# Altium project BSPDLukas.PrjPcb
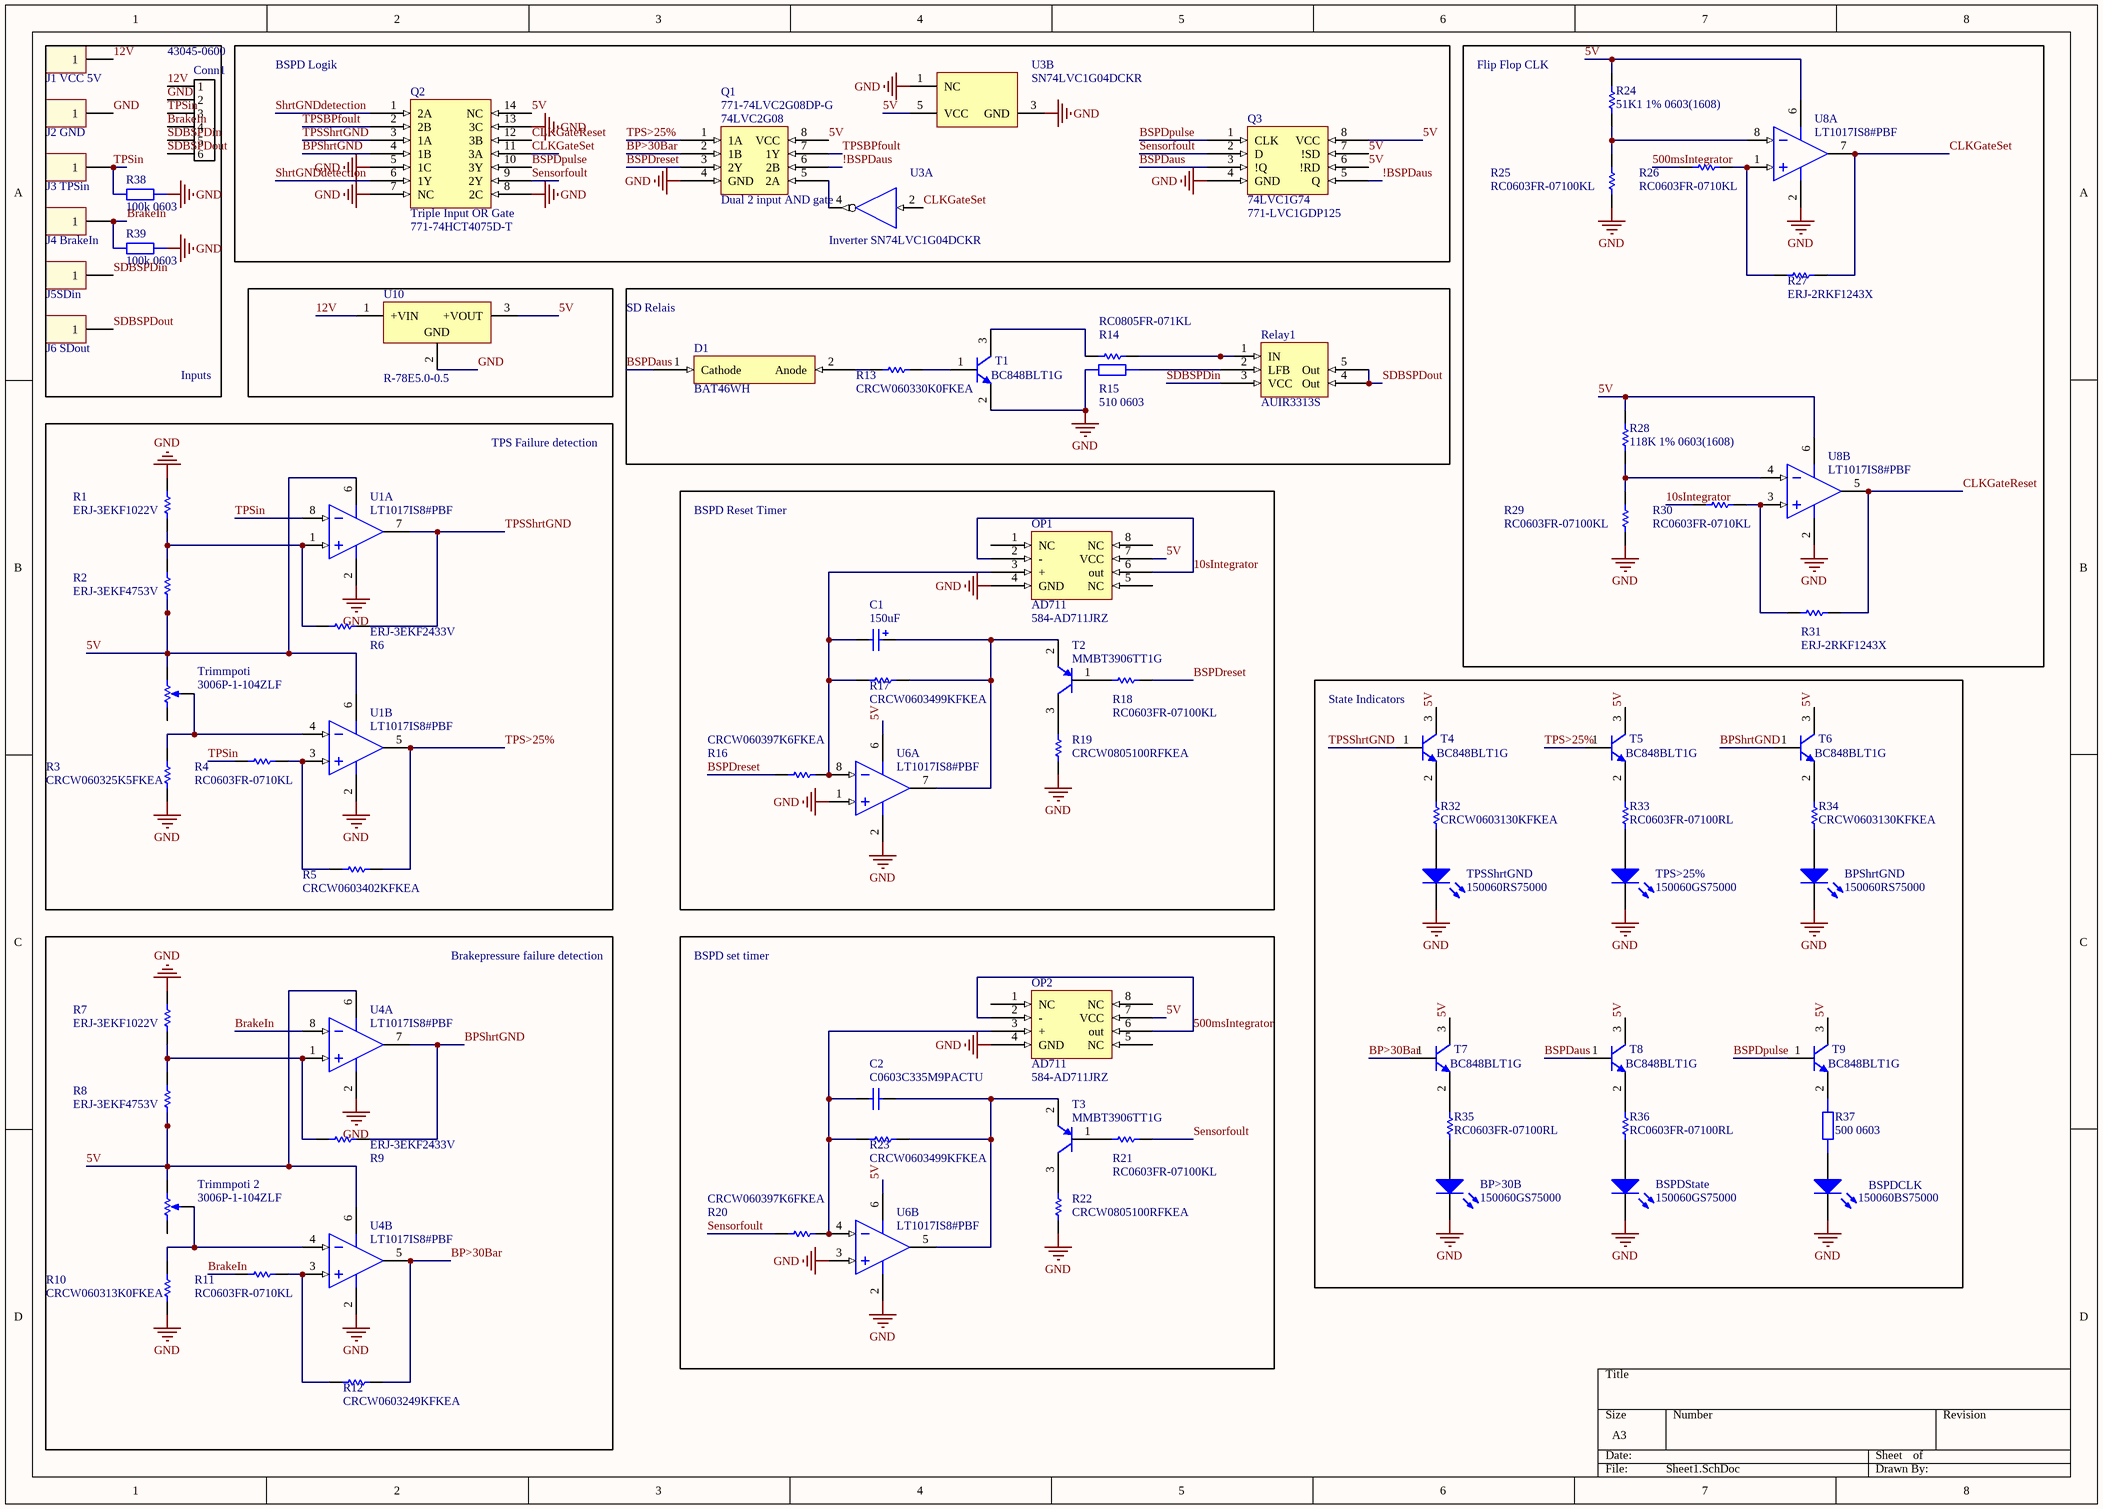
[diagram p0: Sheet1.SchDoc]
1 sheet, 78 parts. Net scope: global (net labels, ports and power ports of the same name join across sheets).
Board files: PCB_BSPDV1_1.PcbDoc, PCB_BSPDV1_2.PcbDoc

## Sheet Sheet1.SchDoc
size A3

### Parts
BP>30B  150060GS75000  [0603_A]
BPShrtGND  150060RS75000  [0603_A]
BSPDCLK  150060BS75000  [0603_A]
BSPDState  150060GS75000  [0603_A]
C1  value 150uF  [WCAP-PSLC_10x12.4]  (hidden comment: 875075561006)
C2  C0603C335M9PACTU  [CAPC1608X90X35NL15T15]
Conn1  43045-0600  [43045-0600]
D1  BAT46WH  [DIOM2715X18N]
J1_VCC_5V  61300111121  [61300111121]  (value not drawn)
J2_GND  61300111121  [61300111121]  (value not drawn)
J3_TPSin  61300111121  [61300111121]  (value not drawn)
J4_BrakeIn  61300111121  [61300111121]  (value not drawn)
J5SDin  61300111121  [61300111121]  (value not drawn)
J6_SDout  61300111121  [61300111121]  (value not drawn)
OP1  AD711  Supplier Part Number 1: 584-AD711JRZ  [SOIC8; SOIC127P600X175-8N]
OP2  AD711  Supplier Part Number 1: 584-AD711JRZ  [SOIC8; SOIC127P600X175-8N]
Q1  Dual 2 input AND gate  Supplier Part Number 1: 771-74LVC2G08DP-G  [TSSOP8; TSOP65P400X110-8N]
Q2  Triple Input OR Gate  Supplier Part Number 1: 771-74HCT4075D-T  [SOIC14; SOIC127P600X175-14N]
Q3  74LVC1G74  Supplier Part Number 1: 771-LVC1GDP125  [TSSOP8; TSOP65P400X110-8N]
R1  ERJ-3EKF1022V  [RESC1608X55X30LL15T15]
R2  ERJ-3EKF4753V  [RESC1608X55X30LL15T15]
R3  CRCW060325K5FKEA  [RESC1609X50X30ML10T20]
R4  RC0603FR-0710KL  [RESC1608X55X25ML10T15]
R5  CRCW0603402KFKEA  [RESC1609X50X30ML10T20]
R6  ERJ-3EKF2433V  [RESC1608X55X30ML15T15]
R7  ERJ-3EKF1022V  [RESC1608X55X30LL15T15]
R8  ERJ-3EKF4753V  [RESC1608X55X30LL15T15]
R9  ERJ-3EKF2433V  [RESC1608X55X30ML15T15]
R10  CRCW060313K0FKEA  [RESC1609X50X30NL10T20]
R11  RC0603FR-0710KL  [RESC1608X55X25ML10T15]
R12  CRCW0603249KFKEA  [RESC1609X50X30NL10T20]
R13  CRCW060330K0FKEA  [RESC1609X50X30LL10T20]
R14  RC0805FR-071KL  [RESC2013X60X35ML10T20]
R15  value 510 0603  [STACKPOLE CSR0603]  (hidden comment: SMD Resistor)
R16  CRCW060397K6FKEA  [RESC1609X50X30LL10T20]
R17  CRCW0603499KFKEA  [RESC1609X50X30NL10T20]
R18  RC0603FR-07100KL  [RESC1608X55X25ML10T15]
R19  CRCW0805100RFKEA  [RESC2013X50X30LL20T20]
R20  CRCW060397K6FKEA  [RESC1609X50X30LL10T20]
R21  RC0603FR-07100KL  [RESC1608X55X25ML10T15]
R22  CRCW0805100RFKEA  [RESC2013X50X30LL20T20]
R23  CRCW0603499KFKEA  [RESC1609X50X30NL10T20]
R24  51K1 1% 0603(1608)  [RESC0603(1608)_L]
R25  RC0603FR-07100KL  [RESC1608X55X25ML10T15]
R26  RC0603FR-0710KL  [RESC1608X55X25ML10T15]
R27  ERJ-2RKF1243X  [RESC1005X40X25NL05T05]
R28  118K 1% 0603(1608)  [RESC0603(1608)_M]
R29  RC0603FR-07100KL  [RESC1608X55X25ML10T15]
R30  RC0603FR-0710KL  [RESC1608X55X25ML10T15]
R31  ERJ-2RKF1243X  [RESC1005X40X25NL05T05]
R32  CRCW0603130KFKEA  [RESC1609X50X30NL10T20]
R33  RC0603FR-07100RL  [RESC1608X55X25ML10T15]
R34  CRCW0603130KFKEA  [RESC1609X50X30NL10T20]
R35  RC0603FR-07100RL  [RESC1608X55X25ML10T15]
R36  RC0603FR-07100RL  [RESC1608X55X25ML10T15]
R37  value 500 0603  [STACKPOLE CSR0603]  (hidden comment: SMD Resistor)
R38  value 100k 0603  [STACKPOLE CSR0603]  (hidden comment: SMD Resistor)
R39  value 100k 0603  [STACKPOLE CSR0603]  (hidden comment: SMD Resistor)
Relay1  AUIR3313S  [D2PAK5 ;DPAK228P1524X483-5N]
T1  BC848BLT1G  [ONSC-SOT-23-3-318-08_V]
T2  MMBT3906TT1G  [ONSC-SC-75-3-463-01_V]
T3  MMBT3906TT1G  [ONSC-SC-75-3-463-01_V]
T4  BC848BLT1G  [ONSC-SOT-23-3-318-08_V]
T5  BC848BLT1G  [ONSC-SOT-23-3-318-08_V]
T6  BC848BLT1G  [ONSC-SOT-23-3-318-08_V]
T7  BC848BLT1G  [ONSC-SOT-23-3-318-08_V]
T8  BC848BLT1G  [ONSC-SOT-23-3-318-08_V]
T9  BC848BLT1G  [ONSC-SOT-23-3-318-08_V]
TPS>25%  150060GS75000  [0603_A]
TPSShrtGND  150060RS75000  [0603_A]
Trimmpoti  3006P-1-104ZLF  [BOUR-3006P-3_V]
Trimmpoti_2  3006P-1-104ZLF  [BOUR-3006P-3_V]
U1  LT1017IS8#PBF  [LT-S8_N]  (parts A,B of 2)
U3  Inverter SN74LVC1G04DCKR  [DCK0005A_N]  (parts A,B of 2)
U4  LT1017IS8#PBF  [LT-S8_N]  (parts A,B of 2)
U6  LT1017IS8#PBF  [LT-S8_N]  (parts A,B of 2)
U8  LT1017IS8#PBF  [LT-S8_N]  (parts A,B of 2)
U10  R-78E5.0-0.5  [REPO-R-78E-0.5-3_V]

### Blocks framed on the sheet
Inputs: Conn1 J1_VCC_5V J2_GND J3_TPSin J4_BrakeIn J5SDin J6_SDout R38 R39
BSPD Logik: Q1-Q3 U3
Flip Flop CLK: R24-R31 U8
SD Relais: D1 R13-R15 Relay1 T1
TPS Failure detection: R1-R6 Trimmpoti U1
BSPD Reset Timer: C1 OP1 R16-R19 T2 U6
State Indicators: BP>30B BPShrtGND BSPDCLK BSPDState R32-R37 T4-T9 TPS>25% TPSShrtGND
Brakepressure failure detection: R7-R12 Trimmpoti_2 U4
BSPD set timer: C2 OP2 R20-R23 T3 U6

### Nets
GND: BP>30B.1(K) BPShrtGND.1(K) BSPDCLK.1(K) BSPDState.1(K) Conn1.2 J2_GND.1 OP1.4(GND) OP2.4(GND) Q1.4(GND) Q2.5(1C) Q2.7(NC) Q2.8(2C) Q2.13(3C) Q3.4(GND) R1.2 R3.1 R7.2 R10.1 R15.1 R19.2 R22.2 R25.1 R29.1 R38.2 R39.2 T1.2(E) TPS>25%.1(K) TPSShrtGND.1(K) U1.2(V-) U3.1(NC) U3.3(GND) U4.2(V-) U6.1(+IN_A) U6.2(V-) U6.3(+IN_B) U8.2(V-) U10.2(GND)
5V: OP1.7(VCC) OP2.7(VCC) Q1.8(VCC) Q2.14(NC) Q3.6(!RD) Q3.7(!SD) Q3.8(VCC) R2.1 R8.1 R24.2 R28.2 T4.3(C) T5.3(C) T6.3(C) T7.3(C) T8.3(C) T9.3(C) Trimmpoti.1(CCW) Trimmpoti_2.1(CCW) U1.6(V+) U3.5(VCC) U4.6(V+) U6.6(V+) U8.6(V+) U10.3(+VOUT)
10sIntegrator: OP1.2(-) OP1.6(out) R30.1
12V: Conn1.1 J1_VCC_5V.1 U10.1(+VIN)
500msIntegrator: OP2.2(-) OP2.6(out) R26.1
!BSPDaus: Q1.6(2B) Q3.5(Q)
BP>30Bar: Q1.2(1B) R12.2 T7.1(B) U4.5(OUT_B)
BPShrtGND: Q2.4(1B) R9.2 T6.1(B) U4.7(OUT_A)
BrakeIn: Conn1.4 J4_BrakeIn.1 R11.1 R39.1 U4.8(-IN_A)
BSPDaus: D1.1(Cathode) Q3.3(!Q) T8.1(B)
BSPDpulse: Q2.10(3Y) Q3.1(CLK) T9.1(B)
BSPDreset: Q1.3(2Y) R16.1 R18.1
CLKGateReset: Q2.12(3B) R31.2 U8.5(OUT_B)
CLKGateSet: Q2.11(3A) R27.2 U3.2(A) U8.7(OUT_A)
SDBSPDin: Conn1.5 J5SDin.1 Relay1.3(VCC)
SDBSPDout: Conn1.6 J6_SDout.1 Relay1.4(Out) Relay1.5(Out)
Sensorfoult: Q2.9(2Y) Q3.2(D) R20.1 R21.1
ShrtGNDdetection: Q2.1(2A) Q2.6(1Y)
TPS>25%: Q1.1(1A) R5.2 T5.1(B) U1.5(OUT_B)
TPSBPfoult: Q1.7(1Y) Q2.2(2B)
TPSin: Conn1.3 J3_TPSin.1 R4.1 R38.1 U1.8(-IN_A)
TPSShrtGND: Q2.3(1A) R6.2 T4.1(B) U1.7(OUT_A)
NetBP>30B_2: BP>30B.2(A) R35.2
NetBPShrtGND_2: BPShrtGND.2(A) R34.1
NetBSPDCLK_2: BSPDCLK.2(A) R37.1
NetBSPDState_2: BSPDState.2(A) R36.2
NetC1_1: C1.1(P) R17.2 T2.2(E) U6.7(OUT_A)
NetC1_2: C1.2(N) OP1.3(+) R16.2 R17.1 U6.8(-IN_A)
NetC2_1: C2.1 OP2.3(+) R20.2 R23.1 U6.4(-IN_B)
NetC2_2: C2.2 R23.2 T3.2(E) U6.5(OUT_B)
NetD1_2: D1.2(Anode) R13.1
NetQ1_5: Q1.5(2A) U3.4(Y)
NetR1_1: R1.1 R2.2 R6.1 U1.1(+IN_A)
NetR3_2: R3.2 Trimmpoti.2(WIPER) U1.4(-IN_B)
NetR4_2: R4.2 R5.1 U1.3(+IN_B)
NetR7_1: R7.1 R8.2 R9.1 U4.1(+IN_A)
NetR10_2: R10.2 Trimmpoti_2.2(WIPER) U4.4(-IN_B)
NetR11_2: R11.2 R12.1 U4.3(+IN_B)
NetR13_2: R13.2 T1.1(B)
NetR14_1: R14.1 T1.3(C)
NetR14_2: R14.2 Relay1.1(IN)
NetR15_2: R15.2 Relay1.2(LFB)
NetR18_2: R18.2 T2.1(B)
NetR19_1: R19.1 T2.3(C)
NetR21_2: R21.2 T3.1(B)
NetR22_1: R22.1 T3.3(C)
NetR24_1: R24.1 R25.2 U8.8(-IN_A)
NetR26_2: R26.2 R27.1 U8.1(+IN_A)
NetR28_1: R28.1 R29.2 U8.4(-IN_B)
NetR30_2: R30.2 R31.1 U8.3(+IN_B)
NetR32_1: R32.1 TPSShrtGND.2(A)
NetR32_2: R32.2 T4.2(E)
NetR33_1: R33.1 T5.2(E)
NetR33_2: R33.2 TPS>25%.2(A)
NetR34_2: R34.2 T6.2(E)
NetR35_1: R35.1 T7.2(E)
NetR36_1: R36.1 T8.2(E)
NetR37_2: R37.2 T9.2(E)

Not connected (* = marked no-connect by the designer): OP1 1(NC) 5(NC) 8(NC); OP2 1(NC) 5(NC) 8(NC); Trimmpoti 3(CW); Trimmpoti_2 3(CW)

### Notes on the sheet
- (in symbol 74LVC2G08-Q100) 74LVC2G08

### Library data of the parts
BP>30B BSPDState TPS>25% = CMP-1426-00002-1: SMD mono-color Chip LED, WL-SMCW, Green; Manufacturer: Wuerth Elektronik; ComponentLink1URL: http://www.we-online.com; ComponentLink2Description: Datasheet; Color: Green; ComponentLink2URL: http://katalog.we-online.com/led/datasheet/150060GS75000.pdf; PartNumber: 150060GS75000; PackageReference: 0603_A; ComponentLink1Description: Manufacturer URL
BPShrtGND TPSShrtGND = CMP-1426-00001-1: SMD mono-color Chip LED, WL-SMCW, Red; Manufacturer: Wuerth Elektronik; Color: Red; PackageReference: 0603_A; ComponentLink2URL: http://katalog.we-online.com/led/datasheet/150060RS75000.pdf; ComponentLink1URL: http://www.we-online.com; ComponentLink1Description: Manufacturer URL; ComponentLink2Description: Datasheet; PartNumber: 150060RS75000
BSPDCLK = CMP-1426-00003-1: SMD mono-color Chip LED, WL-SMCW, Blue; Manufacturer: Wuerth Elektronik; Color: Blue; ComponentLink2Description: Datasheet; ComponentLink2URL: http://katalog.we-online.com/led/datasheet/150060BS75000.pdf; ComponentLink1URL: http://www.we-online.com; PackageReference: 0603_A; PartNumber: 150060BS75000; ComponentLink1Description: Manufacturer URL
C1 = 875075561006: WCAP-PSLC Aluminum Polymer Capacitors, size Ф10x12.4mm, 25V DC, 150uF; Rated Voltage: 25V DC; ComponentLink1Description: Manufacturer; ComponentLink1URL: http://www.we-online.de; ComponentLink2Description: Datasheet; ComponentLink2URL: http://katalog.we-online.de/pbs/datasheet/875075561006.pdf; Part Number: 875075561006; Published Date: June 2017; Publisher: Wurth Elektronik; Size: Ф10x12.4mm; Life Cycle: 2000h; Operating Temperature: -55 °C up to +105 °C
C2 = CMP-2006-02261-1: Manufacturer: Kemet; Part Number: C0603C335M9PACTU
Conn1 = MicroFit3.0 6-Pin: Molex Micro-Fit 3.0 6-Pin / 600V / 8.5A
J1_VCC_5V J2_GND J3_TPSin J4_BrakeIn J5SDin J6_SDout = 61300111121: WR-PHD 2.54 mm THT Pin Header, 1p; Pin Number: 1; Rated Current: 3 A; Working Voltage: 250 VAC; Withstanding Voltage: 500 VAC; Pitch: 2.54 mm; ComponentLink1Description: Manufacturer; ComponentLink1URL: http://www.we-online.de; ComponentLink2Description: Datasheet; ComponentLink2URL: http://katalog.we-online.de/em/datasheet/6130xx11121.pdf; Part Number: 61300111121; Published Date: Aug 2017; Publisher: Wurth Elektronik
Q1 = 74LVC2G08-Q100: Supplier 1: Mouser
Q2 = 74HCT4075D,653: Supplier 1: Mouser
R1 R7 = CMP-2000-00185-1: Manufacturer: Panasonic; Part Number: ERJ-3EKF1022V
R2 R8 = CMP-2000-00528-1: Manufacturer: Panasonic; Part Number: ERJ-3EKF4753V
R3 = CMP-2000-03129-1: Manufacturer: Vishay Dale; Part Number: CRCW060325K5FKEA
R4 R11 R26 R30 = CMP-2100-03664-1: Chip Resistor, 10 KOhm, +/- 1%, 01 W, -55 to 155 degC, 0603 (1608 Metric), RoHS, Tape and Reel; Manufacturer: Yageo; Temperature Coefficient: 100ppm/degreesC; Resistance: 10KOhm; Voltage Rating: 75V; Power Rating: 100mW; Voltage Rating (DC): 50V; Composition: ThickFilm; RoHSCompliant: true; Height: 0.45mm; Lead Free: LeadFree; Case Code (Metric): 1608; Case/Package: 0603; Datasheet Version: Rev. 5, 10/2016; Package Reference: 0603; Depth: 0.8mm; Package Description: 2-Pin Surface Mount Device, Body 1.6 x 0.8 mm; Case Code (Imperial): 0603; Packaging: TapeandReel; Termination: SMD/SMT; Lead Pitch: 0.3mm; Width: 0.8mm; Number of Pins: 2; Length: 1.6mm; REACH SVHC: NoSVHC; Military Standard: Not; Max Operating Temperature: 155degC; Min Operating Temperature: -55degC; Manufacturer URL: http://www.yageo.com/; Datasheet URL: http://www.yageo.com/NewPortal/yageodocoutput?fileName=/pdf/R-Chip/PYu-RC_Group_51_RoHS_L_5.pdf; Weight: 7.1E-05oz; Tolerance: 1%
R5 = CMP-2000-03334-1: Manufacturer: Vishay Dale; Part Number: CRCW0603402KFKEA
R6 R9 = CMP-2000-00367-1: Manufacturer: Panasonic; Part Number: ERJ-3EKF2433V
R10 = CMP-2000-03895-1: Manufacturer: Vishay Dale; Part Number: CRCW060313K0FKEA
R12 = CMP-2000-03115-1: Manufacturer: Vishay Dale; Part Number: CRCW0603249KFKEA
R13 = CMP-2000-03223-1: Manufacturer: Vishay Dale; Part Number: CRCW060330K0FKEA
R14 = CMP-2100-03671-1: Chip Resistor, 1 KOhm, +/- 1%, 125 mW, -55 to 155 degC, 0805 (2012 Metric), RoHS, Tape and Reel; Manufacturer: Yageo; Temperature Coefficient: 100ppm/degreesC; Voltage Rating (DC): 150V; Max Power Dissipation: 125mW; Resistance: 1KOhm; Number of Pins: 2; Number of Terminations: 2; Datasheet URL: http://www.yageo.com/NewPortal/yageodocoutput?fileName=/pdf/R-Chip/PYu-RC_Group_51_RoHS_L_5.pdf; Length: 0.079inch; Package Description: 2-Pin Surface Mounted Device, Body 2 x 1.25 mm; Depth: 1.25mm; Height: 0.024inch; Military Standard: Not; Case/Package: 0805; Package Reference: 0805; RoHSCompliant: true; Lead Free: LeadFree; Packaging: TapeandReel; Package Quantity: 1; Datasheet Version: Rev. 5, 10/2016; Tolerance: 1%; Min Operating Temperature: -55degC; Voltage Rating: 150V; Composition: ThickFilm; Case Code (Imperial): 0805; Power Rating: 125mW; Width: 0.049inch; Case Code (Metric): 2012; Manufacturer URL: http://www.yageo.com/; Max Operating Temperature: 155degC; REACH SVHC: Unknown; Termination: SMD/SMT
R15 R37-R39 = SMD Resistor: Resistor with multiple footprints
R16 R20 = CMP-2000-03650-1: Manufacturer: Vishay Dale; Part Number: CRCW060397K6FKEA
R17 R23 = CMP-2000-03389-1: Manufacturer: Vishay Dale; Part Number: CRCW0603499KFKEA
R18 R21 R25 R29 = CMP-2100-03662-1: Chip Resistor, 100 KOhm, +/- 1%, 0.1 W, -55 to 155 degC, 0603 (1608 Metric), RoHS, Tape and Reel; Manufacturer: Yageo; Power Rating: 100mW; Voltage Rating: 50V; Temperature Coefficient: 100ppm/degreesC; Datasheet Version: Rev. 5, 10/2016; Height: 0.45mm; Lead Free: LeadFree; Manufacturer URL: http://www.yageo.com/; Package Reference: 0603; Depth: 0.8mm; RoHSCompliant: true; Composition: ThickFilm; Military Standard: Not; Resistance: 100KOhm; Case/Package: 0603; Packaging: TapeandReel; Case Code (Imperial): 0603; Voltage Rating (DC): 50V; Case Code (Metric): 1608; Tolerance: 1%; Termination: SMD/SMT; Min Operating Temperature: -55degC; Number of Pins: 2; Length: 1.6mm; Width: 0.8mm; Datasheet URL: http://www.yageo.com/NewPortal/yageodocoutput?fileName=/pdf/R-Chip/PYu-RC_Group_51_RoHS_L_5.pdf; Package Description: 2-Pin Surface Mount Device, Body 1.6 x 0.8 mm; Max Operating Temperature: 155degC; REACH SVHC: NoSVHC
R19 R22 = CMP-2001-04901-1: Manufacturer: Vishay Dale; Part Number: CRCW0805100RFKEA
R24 = CMP-1012-00704-1: 51K1 0.1W 1% 0603 (1608 Metric)  SMD; Case-EIA: 0603; Case-Metric: 1608; Value: 51100.00 Ohm; Technology: SMT; Tolerance: 1 %; Power: 0.1 W
R27 R31 = CMP-2002-00654-1: Manufacturer: Panasonic; Part Number: ERJ-2RKF1243X
R28 = CMP-1012-00743-1: 118K 0.1W 1% 0603 (1608 Metric)  SMD; Case-Metric: 1608; Case-EIA: 0603; Value: 118000.00 Ohm; Technology: SMT; Power: 0.1 W; Tolerance: 1 %
R32 R34 = CMP-2000-03887-1: Manufacturer: Vishay Dale; Part Number: CRCW0603130KFKEA
R33 R35 R36 = CMP-2100-03663-1: Chip Resistor, 100 Ohm, +/- 1%, 0.1 W, -55 to 155 degC, 0603 (1608 Metric), RoHS, Tape and Reel; Manufacturer: Yageo; Voltage Rating (DC): 50V; Power Rating: 100mW; Resistance: 100Ohm; Temperature Coefficient: 100ppm/degreesC; Number of Pins: 2; Tolerance: 1%; Height: 0.45mm; Manufacturer URL: http://www.yageo.com/; Military Standard: Not; Datasheet URL: http://www.yageo.com/NewPortal/yageodocoutput?fileName=/pdf/R-Chip/PYu-RC_Group_51_RoHS_L_5.pdf; Case Code (Imperial): 0603; Termination: SMD/SMT; Lead Free: LeadFree; Max Operating Temperature: 155degC; Case Code (Metric): 1608; RoHSCompliant: true; Voltage Rating: 50V; Width: 0.8mm; Composition: ThickFilm; Depth: 0.8mm; REACH SVHC: Unknown; Min Operating Temperature: -55degC; Packaging: TapeandReel; Package Description: 2-Pin Surface Mount Device, Body 1.6 x 0.8 mm; Length: 1.6mm; Package Reference: 0603; Datasheet Version: Rev. 5, 10/2016; Case/Package: 0603
T1 T4-T9 = CMP-1048-00679-1: General Purpose Transistor, NPN Silicon, 3-Pin SOT-23, Pb-Free, Tape and Reel; Manufacturer: On Semiconductor; fT Min (MHz): 100; IC Continuous (A): 0.1; DatasheetVersion: Rev. 11; PackageVersion: Rev. AP, 11/2009; RoHS: TRUE; PartNumber: BC848BLT1G; ComponentLink1Description: Manufacturer URL; PackageReference: SOT-23-3-318-08; ComponentLink3Description: Package Specification; ComponentLink1URL: http://www.onsemi.com/; Polarity: NPN; ComponentLink2Description: Datasheet; ComponentLink2URL: http://www.onsemi.cn/pub_link/Collateral/BC846ALT1-D.PDF; ComponentLink3URL: http://www.onsemi.cn/pub_link/Collateral/318-08.PDF; PackageDescription: 3-Pin Small Outline Transistor, Body 2.92 x 1.3 mm, Pitch 0.95 mm; Packing: Tape and Reel; Mounting Technology: Surface Mount
T2 T3 = CMP-1048-00413-1: General Purpose Transistor, PNP Silicon, 3-Pin SC-75, Pb-Free, Tape and Reel; Manufacturer: On Semiconductor; fT Min (MHz): 250; IC Continuous (A): -0.2; ComponentLink1URL: http://www.onsemi.com/; ComponentLink3Description: Package Specification; PackageDescription: 3-Pin Small Outline Transistor, Body 1.6 x 0.8 mm, Pitch 0.5 mm; ComponentLink1Description: Manufacturer URL; ComponentLink2Description: Datasheet; RoHS: TRUE; Packing: Tape and Reel; PackageVersion: Rev. F, 07/2005; PartNumber: MMBT3906TT1G; ComponentLink3URL: http://www.onsemi.com/pub_link/Collateral/463-01.PDF; PackageReference: SC-75-3-463-01; Mounting Technology: Surface Mount; Polarity: PNP; DatasheetVersion: Rev. 1; ComponentLink2URL: http://www.onsemi.cn/pub_link/Collateral/MMBT3906TT1-D.PDF
Trimmpoti Trimmpoti_2 = CMP-0975-00010-1: Trimming Potentiometer, 100K Ohm +/- 10%, -55 to 125 degC, 3-Pin 19.05 x 4.83 x 6.6 mm THD, RoHS; Manufacturer: Bourns; Rotational Life: 200 Cycles; Resistance Tolerance: +/- 10%; Resistance (kOhm): 100; Number of Turns: 15; ComponentLink1Description: Manufacturer URL; ComponentLink1URL: http://www.bourns.com/; ComponentLink2URL: http://www.bourns.com/data/global/pdfs/3006.pdf; DatasheetVersion: Apr-14; PartNumber: 3006P-1-104ZLF; ComponentLink3URL: http://www.bourns.com/data/global/pdfs/3006.pdf; PackageDescription: 3-Pin THD, Body 19.05 x 4.83 mm, Height 6.6 mm; Temperature Range: -55 to 125 degC; ComponentLink3Description: Package Specification; RoHS: TRUE; ComponentLink2Description: Datasheet; PackageReference: 3006P-3; PackageVersion: Apr-14; Mounting Technology: Through Hole
U1 U4 U6 U8 = CMP-0360-00547-2: Micropower Comparator, 2 Channels, 1.2 to 40 V, -40 to +85 degC, 8-pin SOP (S8); Manufacturer: Linear Technology; Generic Part Number: LT1017; Prop Delay (us): 22; Vos (mV) Typical: 0.4; Vs Max (V): 40; Vos (mV) Guaranteed: 1; Supply Current (uA) Guaranteed: 60; Vs Min (V): 1.2; Supply Current (uA) Typical: 30; Channels (#): 2; Features: Comparator; ComponentLink1Description: Manufacturer URL; ComponentLink2Description: Datasheet; PackageDescription: 8-Pin Plastic Small Outline (Narrow .150 Inch), Body 4.9 x 3.9 mm, Pitch 1.27 mm; ComponentLink1URL: http://www.linear.com/; PartNumber: LT1017IS8#PBF; RoHS: Y; Mounting Technology: Surface Mount; DatasheetVersion: Rev F; PackageReference: S8; ComponentLink3Description: Package Specification; ComponentLink3URL: http://cds.linear.com/docs/en/packaging/05081610_G_SO8.pdf; ComponentLink2URL: http://cds.linear.com/docs/en/datasheet/10178ff.pdf; Supply Voltage Range: 1.2 to 40 V
U3 = CMP-0859-00252-3: Single Inverter, DCK0005A, LARGE T&R; Manufacturer: Texas Instruments; Input Type: CMOS/TTL; Output Drive (IOL/IOH)(Max)(mA): 32/-32; Sub-Family: Inverting Buffer/Driver; VCC(Min)(V): 1.65; Bits(#): 1; Schmitt Trigger: No; Technology Family: LVC; Rating: Catalog; ICC @ Nom Voltage(Max)(mA): 0.01; tpd @ Nom Voltage(Max)(ns): 7.5,5.2,4.2,3.7; Voltage(Nom)(V): 1.8,2.5,3.3,5; F @ Nom Voltage(Max)(Mhz): 150; Output Type: CMOS; VCC(Max)(V): 5.5; Logic: Inverting; PackageReference: DCK0005A; Generic Part Number: SN74LVC1G04; Operating Temperature Range(C): -40 to 125,-40 to 85; DatasheetVersion: SCES214AD; 3-State Output: No
U10 = CMP-2000-06922-2: DC/DC-Converter, 5 V Single Output, 500 mA, -40 to 85 degC, 3-Pin THD, RoHS, Tube; Manufacturer: Recom Power; Efficiency: 92%; Number of Outputs: 1; Current - Output (Max): 500mA; VIN Min: 7V; Package Version: Rev. 0; VIN Max: 28V; VOUT: 5V; Manufacturer URL: http://www.recom-power.com/us/americas/home.html; Operating Temperature: -40°C~85°C; Datasheet Version: 01/2017; Packaging: Tube; Package Reference: SIP Module; Datasheet URL: http://www.recom-power.com/pdf/Innoline/R-78Exx-0.5.pdf; Package Description: 3-Pin Through Hole Device, Body 11.6 x 8.5 mm, Pitch 2.54 mm; Mounting Technology: ThroughHole
OP1 OP2 = AD711: Supplier 1: Mouser
Q3 = 74LVC1G74: Supplier 1: Mouser